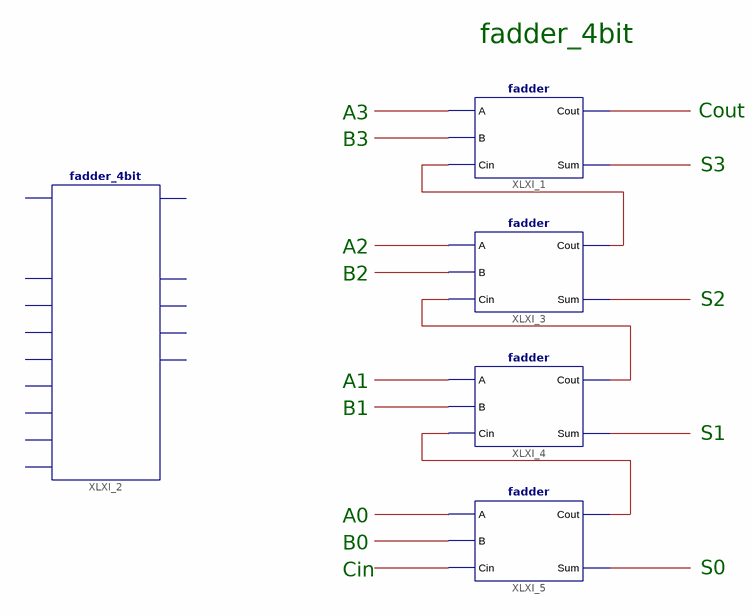
[diagram p0: schematic sheet 1]
// Xilinx ISE schematic FA4b.sch (spartan3e) as structural Verilog: 5 symbols, 0 ports
module FA4b (
);

  wire S0asd, XLXN_1, XLXN_2, XLXN_3, XLXN_5, XLXN_6, XLXN_7, XLXN_9, XLXN_11, XLXN_12, XLXN_13, XLXN_14,
       XLXN_15, XLXN_16, XLXN_17, XLXN_18, XLXN_20;

  fadder_4bit XLXI_2 ();  // open: Cin, Cout, A0, A1, A2, A3, B0, B1, B2, B3, S0, S1, S2, S3
  fadder XLXI_4 (.A(XLXN_15), .B(XLXN_16), .Cin(XLXN_1), .Sum(XLXN_5), .Cout(XLXN_2));
  fadder XLXI_5 (.A(XLXN_17), .B(XLXN_18), .Cin(XLXN_20), .Sum(S0asd), .Cout(XLXN_1));
  fadder XLXI_1 (.A(XLXN_11), .B(XLXN_12), .Cin(XLXN_3), .Sum(XLXN_7), .Cout(XLXN_9));
  fadder XLXI_3 (.A(XLXN_13), .B(XLXN_14), .Cin(XLXN_2), .Sum(XLXN_6), .Cout(XLXN_3));

  // Notes on the sheet:
  //   fadder_4bit
  //   Cout
  //   A3
  //   B3
  //   S3
  //   A2
  //   B2
  //   S2
  //   A1
  //   B1
  //   S1
  //   A0
  //   B0
  //   S0
  //   Cin
endmodule
